# EAGLE schematic FPGA-Validation (EAGLE 9.4.2)

## Sheet 1 of 7
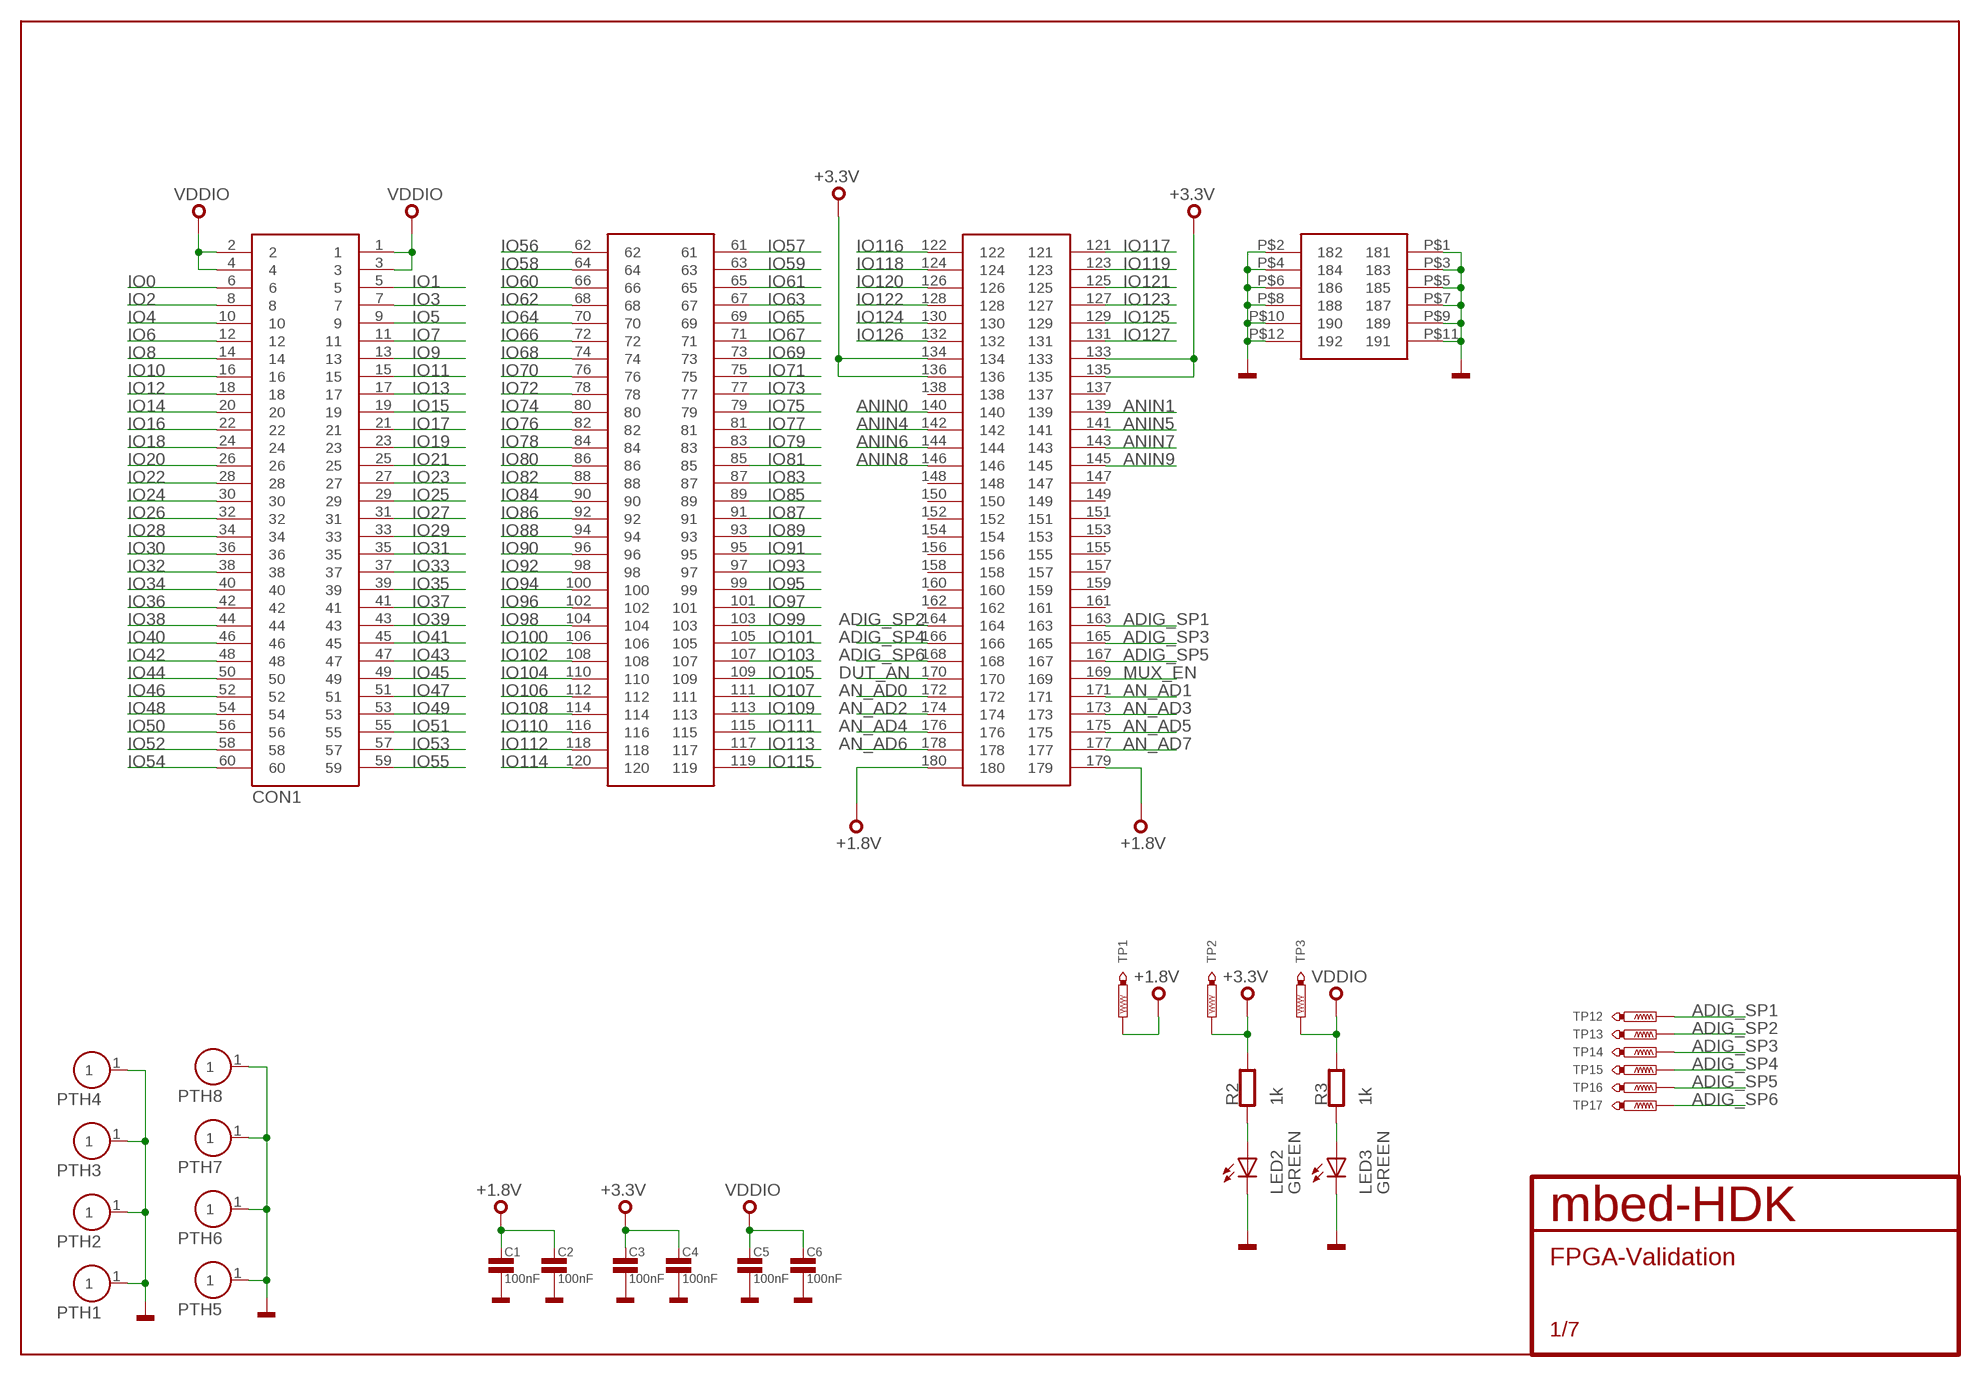
[diagram p0: schematic, sheet 1]

### Parts
C1  100nF  C0603  [0603]
C2  100nF  C0603  [0603]
C3  100nF  C0603  [0603]
C4  100nF  C0603  [0603]
C5  100nF  C0603  [0603]
C6  100nF  C0603  [0603]
CON1  QSH-090-01-L-D-A  [QSH-090-01-L-D-A]
LED2  GREEN  LED0603  [CHIPLED_0603]
LED3  GREEN  LED0603  [CHIPLED_0603]
PTH1  FIXINGHOLE  [PTH-140-300]
PTH2  FIXINGHOLE  [PTH-140-300]
PTH3  FIXINGHOLE  [PTH-140-300]
PTH4  FIXINGHOLE  [PTH-140-300]
PTH5  FIXINGHOLE  [PTH-140-300]
PTH6  FIXINGHOLE  [PTH-140-300]
PTH7  FIXINGHOLE  [PTH-140-300]
PTH8  FIXINGHOLE  [PTH-140-300]
R2  1k  R0603  [0603]
R3  1k  R0603  [0603]
TP1  TEST_POINT-50R-PTH  [TP50-PTH]
TP2  TEST_POINT-50R-PTH  [TP50-PTH]
TP3  TEST_POINT-50R-PTH  [TP50-PTH]
TP12  TEST_POINT-25R-SMD  [TP25-SMD]
TP13  TEST_POINT-25R-SMD  [TP25-SMD]
TP14  TEST_POINT-25R-SMD  [TP25-SMD]
TP15  TEST_POINT-25R-SMD  [TP25-SMD]
TP16  TEST_POINT-25R-SMD  [TP25-SMD]
TP17  TEST_POINT-25R-SMD  [TP25-SMD]

### Nets
+1.8V: C1.1 C2.1 CON1.179 CON1.180 TP1.TP ; also sheet 3,5
+3.3V: C3.1 C4.1 CON1.133 CON1.134 CON1.135 CON1.136 R2.2 TP2.TP ; also sheet 3,4,5
ADIG_SP1: CON1.163 TP12.TP
ADIG_SP2: CON1.164 TP13.TP
ADIG_SP3: CON1.165 TP14.TP
ADIG_SP4: CON1.166 TP15.TP
ADIG_SP5: CON1.167 TP16.TP
ADIG_SP6: CON1.168 TP17.TP
AN_AD0: CON1.172 ; also sheet 3,4,5
AN_AD1: CON1.171 ; also sheet 3,4,5
AN_AD2: CON1.174 ; also sheet 3,4,5
AN_AD3: CON1.173 ; also sheet 3,4,5
AN_AD4: CON1.176 ; also sheet 3,5
AN_AD5: CON1.175 ; also sheet 3,5
AN_AD6: CON1.178 ; also sheet 3,5
AN_AD7: CON1.177 ; also sheet 3,5
ANIN0: CON1.140 ; also sheet 3
ANIN1: CON1.139 ; also sheet 3
ANIN4: CON1.142 ; also sheet 3
ANIN5: CON1.141 ; also sheet 3
ANIN6: CON1.144 ; also sheet 3
ANIN7: CON1.143 ; also sheet 3
ANIN8: CON1.146 ; also sheet 3
ANIN9: CON1.145 ; also sheet 3
DUT_AN: CON1.170 ; also sheet 3,5
GND: C1.2 C2.2 C3.2 C4.2 C5.2 C6.2 CON1.P$1 CON1.P$2 CON1.P$3 CON1.P$4 CON1.P$5 CON1.P$6 CON1.P$7 CON1.P$8 CON1.P$9 CON1.P$10 CON1.P$11 CON1.P$12 LED2.C LED3.C PTH1.1 PTH2.1 PTH3.1 PTH4.1 PTH5.1 PTH6.1 PTH7.1 PTH8.1 ; also sheet 3,4,5,6,7
IO0: CON1.6 ; also sheet 2,4
IO1: CON1.5 ; also sheet 2,4
IO2: CON1.8 ; also sheet 2,4
IO3: CON1.7 ; also sheet 2,4
IO4: CON1.10 ; also sheet 2,4
IO5: CON1.9 ; also sheet 2,4
IO6: CON1.12 ; also sheet 2,4
IO7: CON1.11 ; also sheet 2,4
IO8: CON1.14 ; also sheet 2,4
IO9: CON1.13 ; also sheet 2,4
IO10: CON1.16 ; also sheet 2,4
IO11: CON1.15 ; also sheet 2,4
IO12: CON1.18 ; also sheet 2,4
IO13: CON1.17 ; also sheet 2,4
IO14: CON1.20 ; also sheet 2,4
IO15: CON1.19 ; also sheet 2,4
IO16: CON1.22 ; also sheet 2,4
IO17: CON1.21 ; also sheet 2,4
IO18: CON1.24 ; also sheet 2,4
IO19: CON1.23 ; also sheet 2,4
IO20: CON1.26 ; also sheet 2,4
IO21: CON1.25 ; also sheet 2,4
IO22: CON1.28 ; also sheet 2,4
IO23: CON1.27 ; also sheet 2,4
IO24: CON1.30 ; also sheet 2,4
IO25: CON1.29 ; also sheet 2,4
IO26: CON1.32 ; also sheet 2,4
IO27: CON1.31 ; also sheet 2,4
IO28: CON1.34 ; also sheet 2,4
IO29: CON1.33 ; also sheet 2,4
IO30: CON1.36 ; also sheet 2,4
IO31: CON1.35 ; also sheet 2,4
IO32: CON1.38 ; also sheet 2,4
IO33: CON1.37 ; also sheet 2,4
IO34: CON1.40 ; also sheet 2,4
IO35: CON1.39 ; also sheet 2,4
IO36: CON1.42 ; also sheet 2,4
IO37: CON1.41 ; also sheet 2,4
IO38: CON1.44 ; also sheet 2,4
IO39: CON1.43 ; also sheet 2,4
IO40: CON1.46 ; also sheet 2,4
IO41: CON1.45 ; also sheet 2,4
IO42: CON1.48 ; also sheet 2,4
IO43: CON1.47 ; also sheet 2,4
IO44: CON1.50 ; also sheet 2,4
IO45: CON1.49 ; also sheet 2,4
IO46: CON1.52 ; also sheet 2,4
IO47: CON1.51 ; also sheet 2,4
IO48: CON1.54 ; also sheet 2,4
IO49: CON1.53 ; also sheet 2,4
IO50: CON1.56 ; also sheet 2,4
IO51: CON1.55 ; also sheet 2,4
IO52: CON1.58 ; also sheet 2,4
IO53: CON1.57 ; also sheet 2,4
IO54: CON1.60 ; also sheet 2,4
IO55: CON1.59 ; also sheet 2,4
IO56: CON1.62 ; also sheet 2,4
IO57: CON1.61 ; also sheet 2,4
IO58: CON1.64 ; also sheet 2,4
IO59: CON1.63 ; also sheet 2,4
IO60: CON1.66 ; also sheet 2,4
IO61: CON1.65 ; also sheet 2,4
IO62: CON1.68 ; also sheet 2,4
IO63: CON1.67 ; also sheet 2,4
IO64: CON1.70 ; also sheet 2,5
IO65: CON1.69 ; also sheet 2,5
IO66: CON1.72 ; also sheet 2,5
IO67: CON1.71 ; also sheet 2,5
IO68: CON1.74 ; also sheet 2,5
IO69: CON1.73 ; also sheet 2,5
IO70: CON1.76 ; also sheet 2,5
IO71: CON1.75 ; also sheet 2,5
IO72: CON1.78 ; also sheet 2,5
IO73: CON1.77 ; also sheet 2,5
IO74: CON1.80 ; also sheet 2,5
IO75: CON1.79 ; also sheet 2,5
IO76: CON1.82 ; also sheet 2,5
IO77: CON1.81 ; also sheet 2,5
IO78: CON1.84 ; also sheet 2,5
IO79: CON1.83 ; also sheet 2,5
IO80: CON1.86 ; also sheet 2,5
IO81: CON1.85 ; also sheet 2,5
IO82: CON1.88 ; also sheet 2,5
IO83: CON1.87 ; also sheet 2,5
IO84: CON1.90 ; also sheet 2,5
IO85: CON1.89 ; also sheet 2,5
IO86: CON1.92 ; also sheet 2,5
IO87: CON1.91 ; also sheet 2,5
IO88: CON1.94 ; also sheet 2,5
IO89: CON1.93 ; also sheet 2,5
IO90: CON1.96 ; also sheet 2,5
IO91: CON1.95 ; also sheet 2,5
IO92: CON1.98 ; also sheet 2,5
IO93: CON1.97 ; also sheet 2,5
IO94: CON1.100 ; also sheet 2,5
IO95: CON1.99 ; also sheet 2,5
IO96: CON1.102 ; also sheet 2,5
IO97: CON1.101 ; also sheet 2,5
IO98: CON1.104 ; also sheet 2,5
IO99: CON1.103 ; also sheet 2,5
IO100: CON1.106 ; also sheet 2,5
IO101: CON1.105 ; also sheet 2,5
IO102: CON1.108 ; also sheet 2,5
IO103: CON1.107 ; also sheet 2,5
IO104: CON1.110 ; also sheet 2,5
IO105: CON1.109 ; also sheet 2,5
IO106: CON1.112 ; also sheet 2,5
IO107: CON1.111 ; also sheet 2,5
IO108: CON1.114 ; also sheet 2,5
IO109: CON1.113 ; also sheet 2,5
IO110: CON1.116 ; also sheet 2,5
IO111: CON1.115 ; also sheet 2,5
IO112: CON1.118 ; also sheet 2,5
IO113: CON1.117 ; also sheet 2,5
IO114: CON1.120 ; also sheet 2,5
IO115: CON1.119 ; also sheet 2,5
IO116: CON1.122 ; also sheet 2,5
IO117: CON1.121 ; also sheet 2,5
IO118: CON1.124 ; also sheet 2,5
IO119: CON1.123 ; also sheet 2,5
IO120: CON1.126 ; also sheet 2,5
IO121: CON1.125 ; also sheet 2,5
IO122: CON1.128 ; also sheet 2,5
IO123: CON1.127 ; also sheet 2,5
IO124: CON1.130 ; also sheet 2,5
IO125: CON1.129 ; also sheet 2,5
IO126: CON1.132 ; also sheet 2,5
IO127: CON1.131 ; also sheet 2,5
MUX_EN: CON1.169 ; also sheet 3,4,5
N$1: LED3.A R3.1
N$3: LED2.A R2.1
VDDIO: C5.1 C6.1 CON1.1 CON1.2 CON1.3 CON1.4 R3.2 TP3.TP ; also sheet 3,5
Unconnected: CON1.137 CON1.138 CON1.147 CON1.148 CON1.149 CON1.150 CON1.151 CON1.152 CON1.153 CON1.154 CON1.155 CON1.156 CON1.157 CON1.158 CON1.159 CON1.160 CON1.161 CON1.162

## Sheet 2 of 7
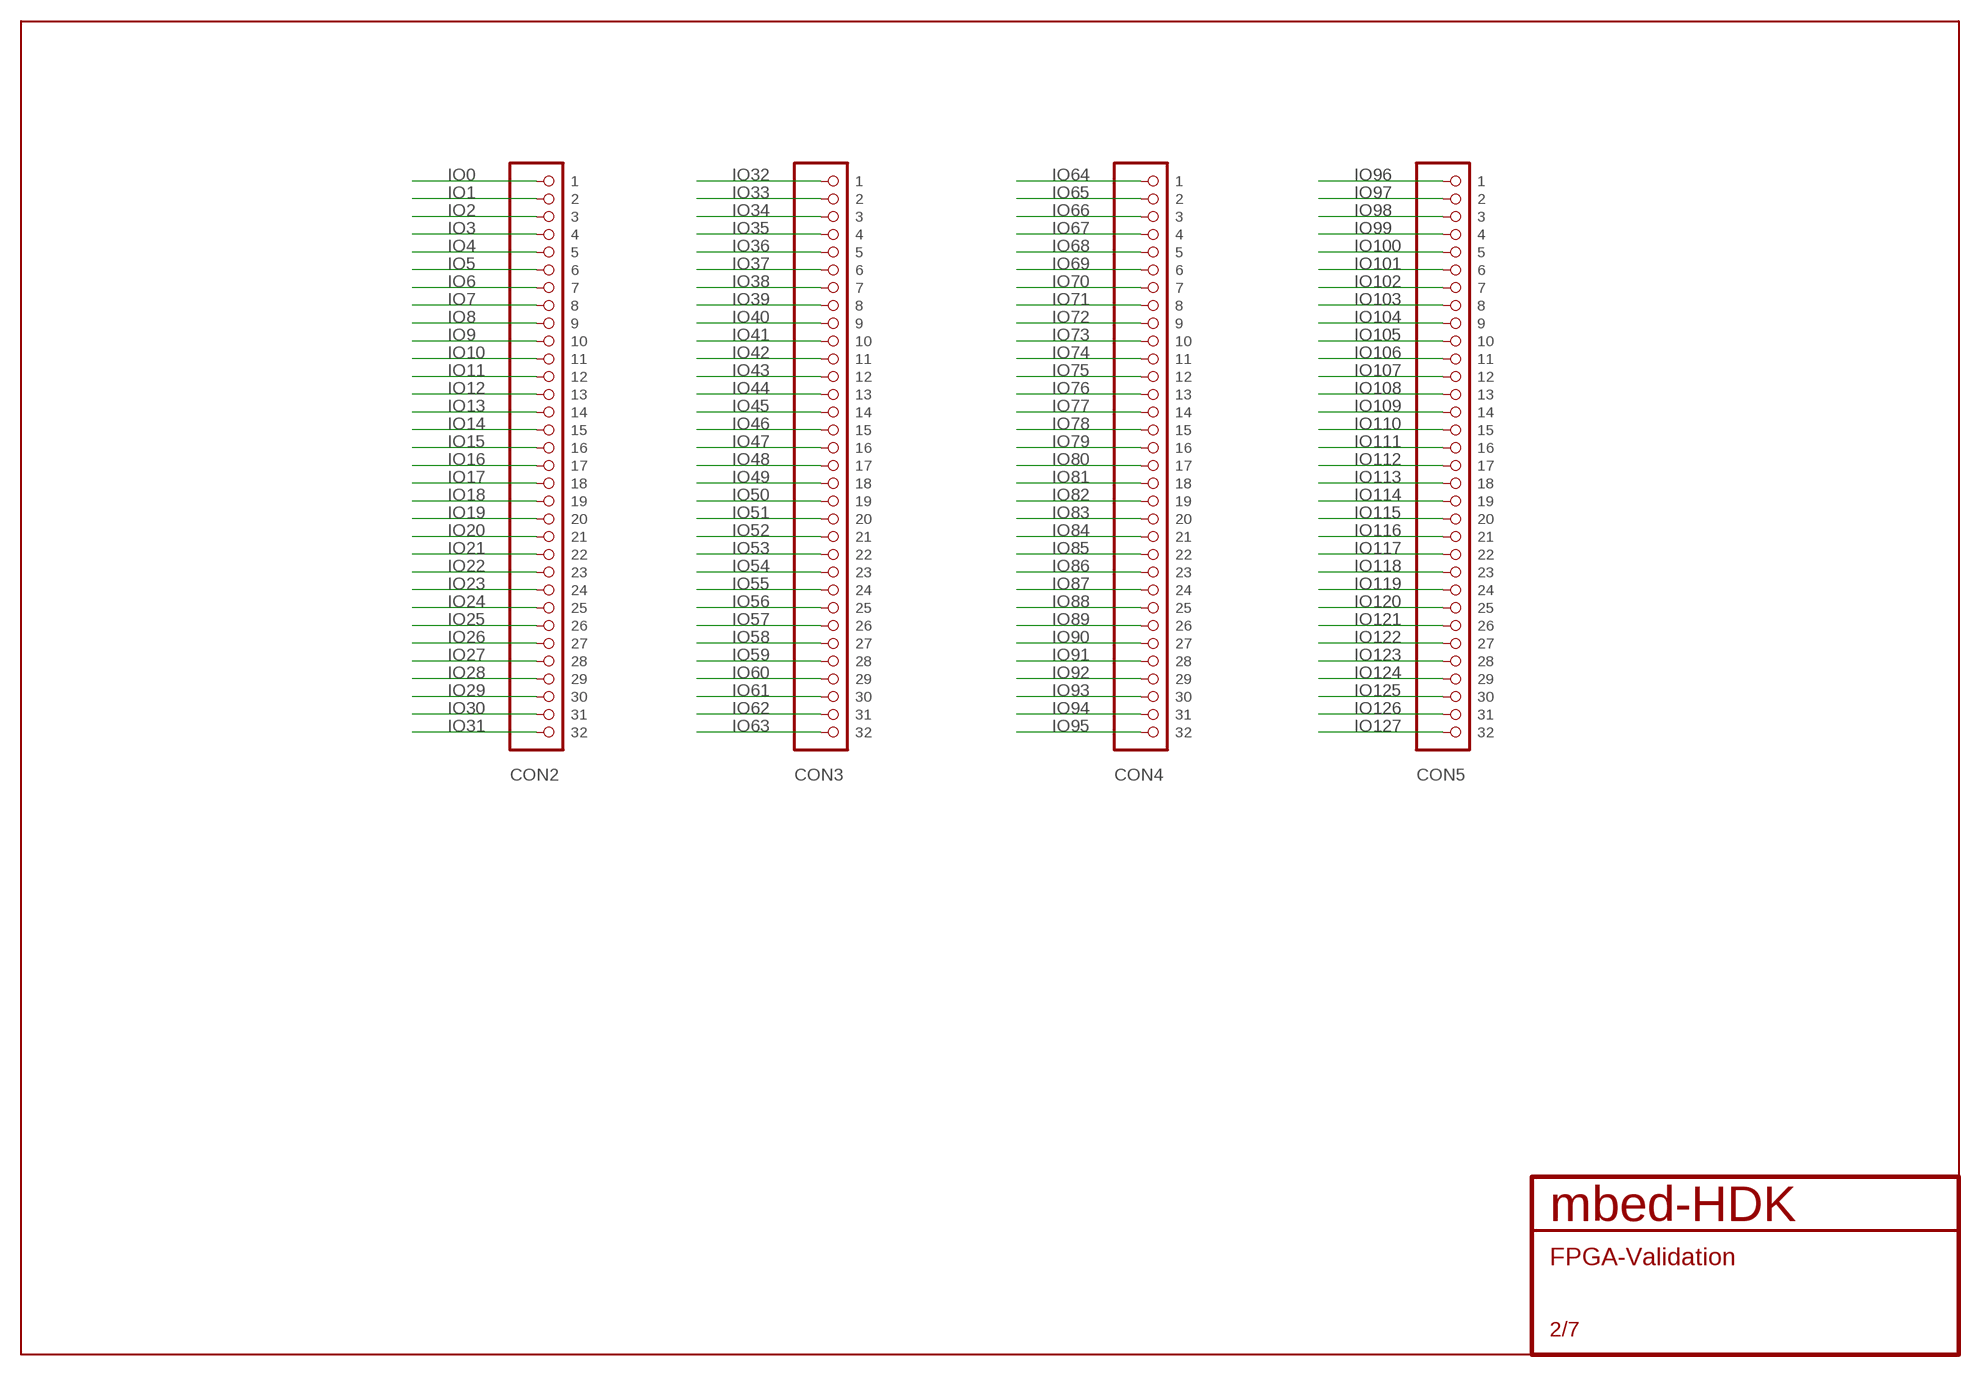
[diagram p1: schematic, sheet 2]

### Parts
CON2  PINHD-1X32  [1X32]
CON3  PINHD-1X32  [1X32]
CON4  PINHD-1X32  [1X32]
CON5  PINHD-1X32  [1X32]

### Nets
IO0: CON2.1 ; also sheet 1,4
IO1: CON2.2 ; also sheet 1,4
IO2: CON2.3 ; also sheet 1,4
IO3: CON2.4 ; also sheet 1,4
IO4: CON2.5 ; also sheet 1,4
IO5: CON2.6 ; also sheet 1,4
IO6: CON2.7 ; also sheet 1,4
IO7: CON2.8 ; also sheet 1,4
IO8: CON2.9 ; also sheet 1,4
IO9: CON2.10 ; also sheet 1,4
IO10: CON2.11 ; also sheet 1,4
IO11: CON2.12 ; also sheet 1,4
IO12: CON2.13 ; also sheet 1,4
IO13: CON2.14 ; also sheet 1,4
IO14: CON2.15 ; also sheet 1,4
IO15: CON2.16 ; also sheet 1,4
IO16: CON2.17 ; also sheet 1,4
IO17: CON2.18 ; also sheet 1,4
IO18: CON2.19 ; also sheet 1,4
IO19: CON2.20 ; also sheet 1,4
IO20: CON2.21 ; also sheet 1,4
IO21: CON2.22 ; also sheet 1,4
IO22: CON2.23 ; also sheet 1,4
IO23: CON2.24 ; also sheet 1,4
IO24: CON2.25 ; also sheet 1,4
IO25: CON2.26 ; also sheet 1,4
IO26: CON2.27 ; also sheet 1,4
IO27: CON2.28 ; also sheet 1,4
IO28: CON2.29 ; also sheet 1,4
IO29: CON2.30 ; also sheet 1,4
IO30: CON2.31 ; also sheet 1,4
IO31: CON2.32 ; also sheet 1,4
IO32: CON3.1 ; also sheet 1,4
IO33: CON3.2 ; also sheet 1,4
IO34: CON3.3 ; also sheet 1,4
IO35: CON3.4 ; also sheet 1,4
IO36: CON3.5 ; also sheet 1,4
IO37: CON3.6 ; also sheet 1,4
IO38: CON3.7 ; also sheet 1,4
IO39: CON3.8 ; also sheet 1,4
IO40: CON3.9 ; also sheet 1,4
IO41: CON3.10 ; also sheet 1,4
IO42: CON3.11 ; also sheet 1,4
IO43: CON3.12 ; also sheet 1,4
IO44: CON3.13 ; also sheet 1,4
IO45: CON3.14 ; also sheet 1,4
IO46: CON3.15 ; also sheet 1,4
IO47: CON3.16 ; also sheet 1,4
IO48: CON3.17 ; also sheet 1,4
IO49: CON3.18 ; also sheet 1,4
IO50: CON3.19 ; also sheet 1,4
IO51: CON3.20 ; also sheet 1,4
IO52: CON3.21 ; also sheet 1,4
IO53: CON3.22 ; also sheet 1,4
IO54: CON3.23 ; also sheet 1,4
IO55: CON3.24 ; also sheet 1,4
IO56: CON3.25 ; also sheet 1,4
IO57: CON3.26 ; also sheet 1,4
IO58: CON3.27 ; also sheet 1,4
IO59: CON3.28 ; also sheet 1,4
IO60: CON3.29 ; also sheet 1,4
IO61: CON3.30 ; also sheet 1,4
IO62: CON3.31 ; also sheet 1,4
IO63: CON3.32 ; also sheet 1,4
IO64: CON4.1 ; also sheet 1,5
IO65: CON4.2 ; also sheet 1,5
IO66: CON4.3 ; also sheet 1,5
IO67: CON4.4 ; also sheet 1,5
IO68: CON4.5 ; also sheet 1,5
IO69: CON4.6 ; also sheet 1,5
IO70: CON4.7 ; also sheet 1,5
IO71: CON4.8 ; also sheet 1,5
IO72: CON4.9 ; also sheet 1,5
IO73: CON4.10 ; also sheet 1,5
IO74: CON4.11 ; also sheet 1,5
IO75: CON4.12 ; also sheet 1,5
IO76: CON4.13 ; also sheet 1,5
IO77: CON4.14 ; also sheet 1,5
IO78: CON4.15 ; also sheet 1,5
IO79: CON4.16 ; also sheet 1,5
IO80: CON4.17 ; also sheet 1,5
IO81: CON4.18 ; also sheet 1,5
IO82: CON4.19 ; also sheet 1,5
IO83: CON4.20 ; also sheet 1,5
IO84: CON4.21 ; also sheet 1,5
IO85: CON4.22 ; also sheet 1,5
IO86: CON4.23 ; also sheet 1,5
IO87: CON4.24 ; also sheet 1,5
IO88: CON4.25 ; also sheet 1,5
IO89: CON4.26 ; also sheet 1,5
IO90: CON4.27 ; also sheet 1,5
IO91: CON4.28 ; also sheet 1,5
IO92: CON4.29 ; also sheet 1,5
IO93: CON4.30 ; also sheet 1,5
IO94: CON4.31 ; also sheet 1,5
IO95: CON4.32 ; also sheet 1,5
IO96: CON5.1 ; also sheet 1,5
IO97: CON5.2 ; also sheet 1,5
IO98: CON5.3 ; also sheet 1,5
IO99: CON5.4 ; also sheet 1,5
IO100: CON5.5 ; also sheet 1,5
IO101: CON5.6 ; also sheet 1,5
IO102: CON5.7 ; also sheet 1,5
IO103: CON5.8 ; also sheet 1,5
IO104: CON5.9 ; also sheet 1,5
IO105: CON5.10 ; also sheet 1,5
IO106: CON5.11 ; also sheet 1,5
IO107: CON5.12 ; also sheet 1,5
IO108: CON5.13 ; also sheet 1,5
IO109: CON5.14 ; also sheet 1,5
IO110: CON5.15 ; also sheet 1,5
IO111: CON5.16 ; also sheet 1,5
IO112: CON5.17 ; also sheet 1,5
IO113: CON5.18 ; also sheet 1,5
IO114: CON5.19 ; also sheet 1,5
IO115: CON5.20 ; also sheet 1,5
IO116: CON5.21 ; also sheet 1,5
IO117: CON5.22 ; also sheet 1,5
IO118: CON5.23 ; also sheet 1,5
IO119: CON5.24 ; also sheet 1,5
IO120: CON5.25 ; also sheet 1,5
IO121: CON5.26 ; also sheet 1,5
IO122: CON5.27 ; also sheet 1,5
IO123: CON5.28 ; also sheet 1,5
IO124: CON5.29 ; also sheet 1,5
IO125: CON5.30 ; also sheet 1,5
IO126: CON5.31 ; also sheet 1,5
IO127: CON5.32 ; also sheet 1,5

## Sheet 3 of 7
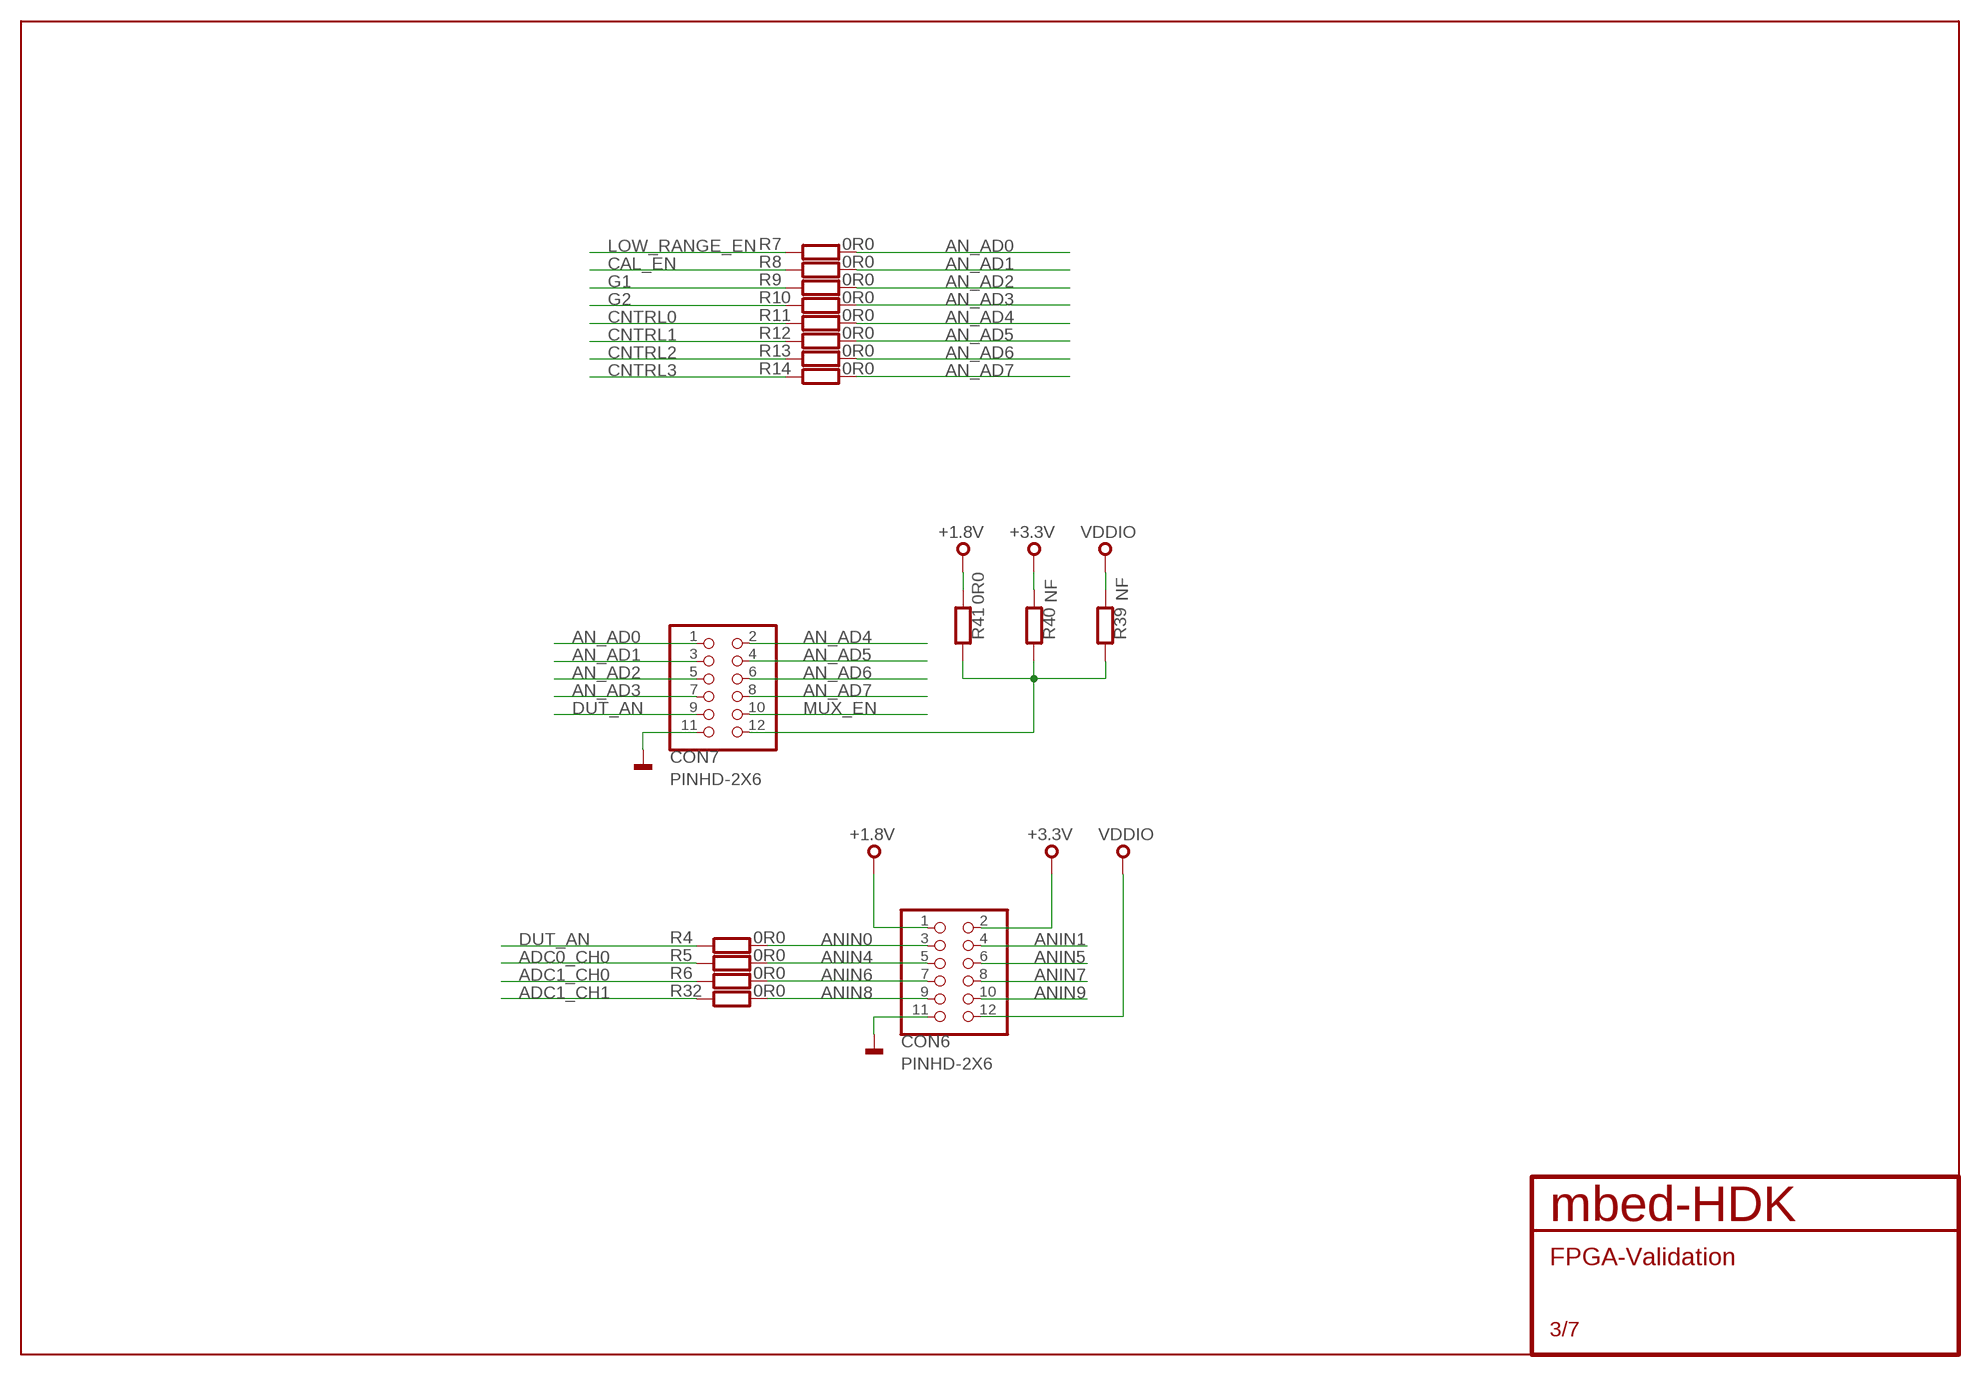
[diagram p2: schematic, sheet 3]

### Parts
CON6  PINHD-2X6  [2X06]
CON7  PINHD-2X6  [2X06]
R4  0R0  R0603  [0603]
R5  0R0  R0603  [0603]
R6  0R0  R0603  [0603]
R7  0R0  R0603  [0603]
R8  0R0  R0603  [0603]
R9  0R0  R0603  [0603]
R10  0R0  R0603  [0603]
R11  0R0  R0603  [0603]
R12  0R0  R0603  [0603]
R13  0R0  R0603  [0603]
R14  0R0  R0603  [0603]
R32  0R0  R0603  [0603]
R39  NF  R0603  [0603]
R40  NF  R0603  [0603]
R41  0R0  R0603  [0603]

### Nets
+1.8V: CON6.1 R41.1 ; also sheet 1,5
+3.3V: CON6.2 R40.1 ; also sheet 1,4,5
ADC0_CH0: R5.1 ; also sheet 6
ADC1_CH0: R6.1 ; also sheet 6
ADC1_CH1: R32.1 ; also sheet 6
AN_AD0: CON7.1 R7.2 ; also sheet 1,4,5
AN_AD1: CON7.3 R8.2 ; also sheet 1,4,5
AN_AD2: CON7.5 R9.2 ; also sheet 1,4,5
AN_AD3: CON7.7 R10.2 ; also sheet 1,4,5
AN_AD4: CON7.2 R11.2 ; also sheet 1,5
AN_AD5: CON7.4 R12.2 ; also sheet 1,5
AN_AD6: CON7.6 R13.2 ; also sheet 1,5
AN_AD7: CON7.8 R14.2 ; also sheet 1,5
ANIN0: CON6.3 R4.2 ; also sheet 1
ANIN1: CON6.4 ; also sheet 1
ANIN4: CON6.5 R5.2 ; also sheet 1
ANIN5: CON6.6 ; also sheet 1
ANIN6: CON6.7 R6.2 ; also sheet 1
ANIN7: CON6.8 ; also sheet 1
ANIN8: CON6.9 R32.2 ; also sheet 1
ANIN9: CON6.10 ; also sheet 1
CAL_EN: R8.1 ; also sheet 7
CNTRL0: R11.1 ; also sheet 7
CNTRL1: R12.1 ; also sheet 7
CNTRL2: R13.1 ; also sheet 7
CNTRL3: R14.1 ; also sheet 7
DUT_AN: CON7.9 R4.1 ; also sheet 1,5
G1: R9.1 ; also sheet 6
G2: R10.1 ; also sheet 6
GND: CON6.11 CON7.11 ; also sheet 1,4,5,6,7
LOW_RANGE_EN: R7.1 ; also sheet 7
MUX_EN: CON7.10 ; also sheet 1,4,5
N$8: CON7.12 R39.2 R40.2 R41.2
VDDIO: CON6.12 R39.1 ; also sheet 1,5

## Sheet 4 of 7
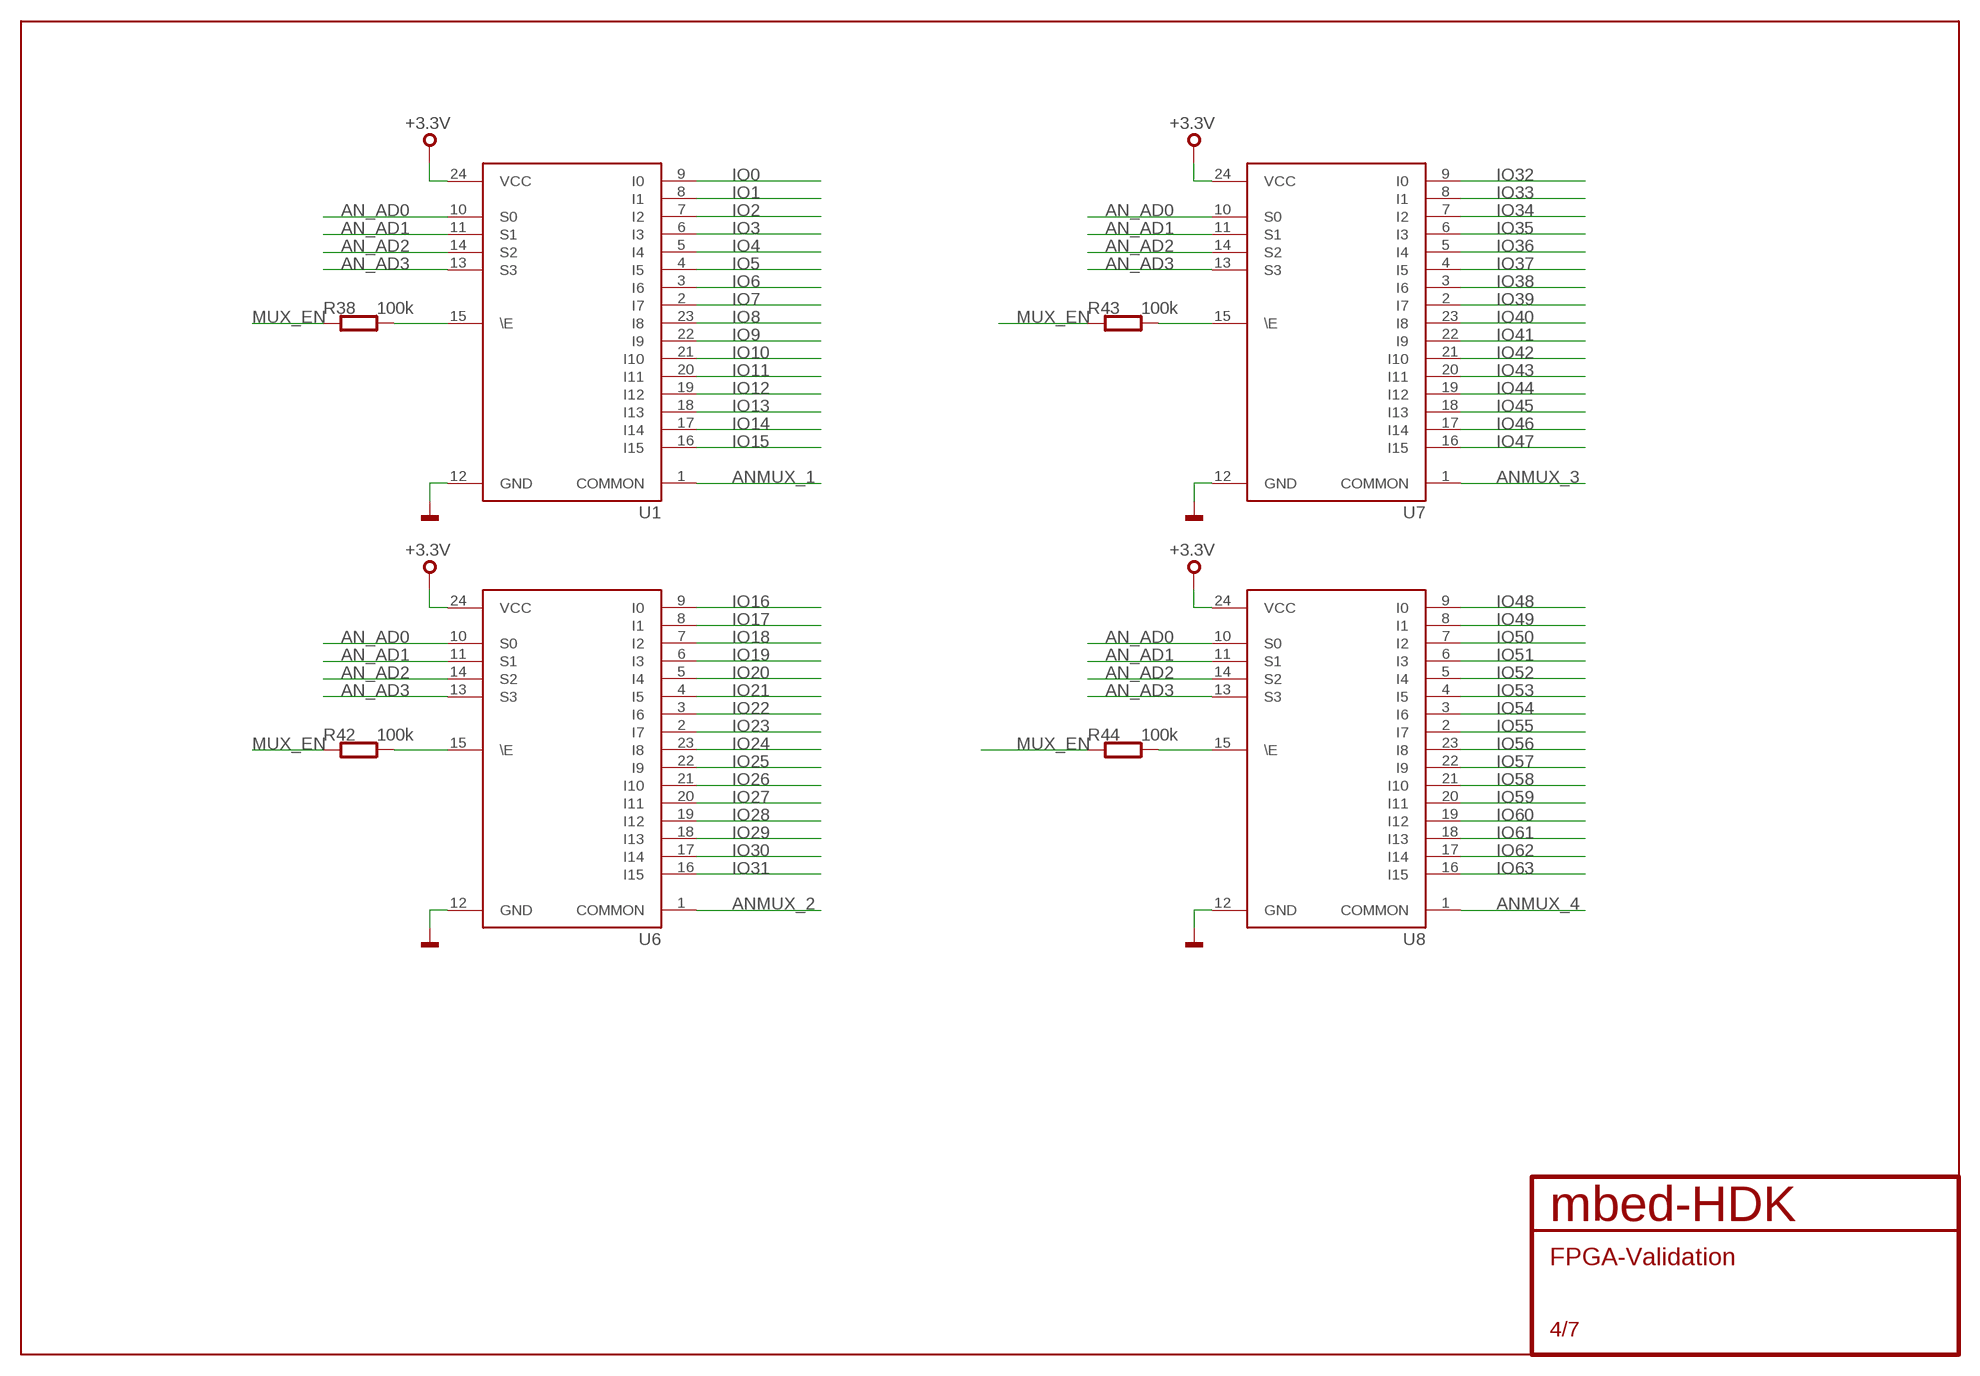
[diagram p3: schematic, sheet 4]

### Parts
R38  100k  R0603  [0603]
R42  100k  R0603  [0603]
R43  100k  R0603  [0603]
R44  100k  R0603  [0603]
U1  CD74HCT4067  [SO24]
U6  CD74HCT4067  [SO24]
U7  CD74HCT4067  [SO24]
U8  CD74HCT4067  [SO24]

### Nets
+3.3V: U1.24(VCC) U6.24(VCC) U7.24(VCC) U8.24(VCC) ; also sheet 1,3,5
AN_AD0: U1.10(S0) U6.10(S0) U7.10(S0) U8.10(S0) ; also sheet 1,3,5
AN_AD1: U1.11(S1) U6.11(S1) U7.11(S1) U8.11(S1) ; also sheet 1,3,5
AN_AD2: U1.14(S2) U6.14(S2) U7.14(S2) U8.14(S2) ; also sheet 1,3,5
AN_AD3: U1.13(S3) U6.13(S3) U7.13(S3) U8.13(S3) ; also sheet 1,3,5
ANMUX_1: U1.1(COMMON) ; also sheet 5
ANMUX_2: U6.1(COMMON) ; also sheet 5
ANMUX_3: U7.1(COMMON) ; also sheet 5
ANMUX_4: U8.1(COMMON) ; also sheet 5
GND: U1.12(GND) U6.12(GND) U7.12(GND) U8.12(GND) ; also sheet 1,3,5,6,7
IO0: U1.9(I0) ; also sheet 1,2
IO1: U1.8(I1) ; also sheet 1,2
IO2: U1.7(I2) ; also sheet 1,2
IO3: U1.6(I3) ; also sheet 1,2
IO4: U1.5(I4) ; also sheet 1,2
IO5: U1.4(I5) ; also sheet 1,2
IO6: U1.3(I6) ; also sheet 1,2
IO7: U1.2(I7) ; also sheet 1,2
IO8: U1.23(I8) ; also sheet 1,2
IO9: U1.22(I9) ; also sheet 1,2
IO10: U1.21(I10) ; also sheet 1,2
IO11: U1.20(I11) ; also sheet 1,2
IO12: U1.19(I12) ; also sheet 1,2
IO13: U1.18(I13) ; also sheet 1,2
IO14: U1.17(I14) ; also sheet 1,2
IO15: U1.16(I15) ; also sheet 1,2
IO16: U6.9(I0) ; also sheet 1,2
IO17: U6.8(I1) ; also sheet 1,2
IO18: U6.7(I2) ; also sheet 1,2
IO19: U6.6(I3) ; also sheet 1,2
IO20: U6.5(I4) ; also sheet 1,2
IO21: U6.4(I5) ; also sheet 1,2
IO22: U6.3(I6) ; also sheet 1,2
IO23: U6.2(I7) ; also sheet 1,2
IO24: U6.23(I8) ; also sheet 1,2
IO25: U6.22(I9) ; also sheet 1,2
IO26: U6.21(I10) ; also sheet 1,2
IO27: U6.20(I11) ; also sheet 1,2
IO28: U6.19(I12) ; also sheet 1,2
IO29: U6.18(I13) ; also sheet 1,2
IO30: U6.17(I14) ; also sheet 1,2
IO31: U6.16(I15) ; also sheet 1,2
IO32: U7.9(I0) ; also sheet 1,2
IO33: U7.8(I1) ; also sheet 1,2
IO34: U7.7(I2) ; also sheet 1,2
IO35: U7.6(I3) ; also sheet 1,2
IO36: U7.5(I4) ; also sheet 1,2
IO37: U7.4(I5) ; also sheet 1,2
IO38: U7.3(I6) ; also sheet 1,2
IO39: U7.2(I7) ; also sheet 1,2
IO40: U7.23(I8) ; also sheet 1,2
IO41: U7.22(I9) ; also sheet 1,2
IO42: U7.21(I10) ; also sheet 1,2
IO43: U7.20(I11) ; also sheet 1,2
IO44: U7.19(I12) ; also sheet 1,2
IO45: U7.18(I13) ; also sheet 1,2
IO46: U7.17(I14) ; also sheet 1,2
IO47: U7.16(I15) ; also sheet 1,2
IO48: U8.9(I0) ; also sheet 1,2
IO49: U8.8(I1) ; also sheet 1,2
IO50: U8.7(I2) ; also sheet 1,2
IO51: U8.6(I3) ; also sheet 1,2
IO52: U8.5(I4) ; also sheet 1,2
IO53: U8.4(I5) ; also sheet 1,2
IO54: U8.3(I6) ; also sheet 1,2
IO55: U8.2(I7) ; also sheet 1,2
IO56: U8.23(I8) ; also sheet 1,2
IO57: U8.22(I9) ; also sheet 1,2
IO58: U8.21(I10) ; also sheet 1,2
IO59: U8.20(I11) ; also sheet 1,2
IO60: U8.19(I12) ; also sheet 1,2
IO61: U8.18(I13) ; also sheet 1,2
IO62: U8.17(I14) ; also sheet 1,2
IO63: U8.16(I15) ; also sheet 1,2
MUX_EN: R38.1 R42.1 R43.1 R44.1 ; also sheet 1,3,5
N$4: R42.2 U6.15(\E)
N$9: R43.2 U7.15(\E)
N$10: R38.2 U1.15(\E)
N$11: R44.2 U8.15(\E)

## Sheet 5 of 7
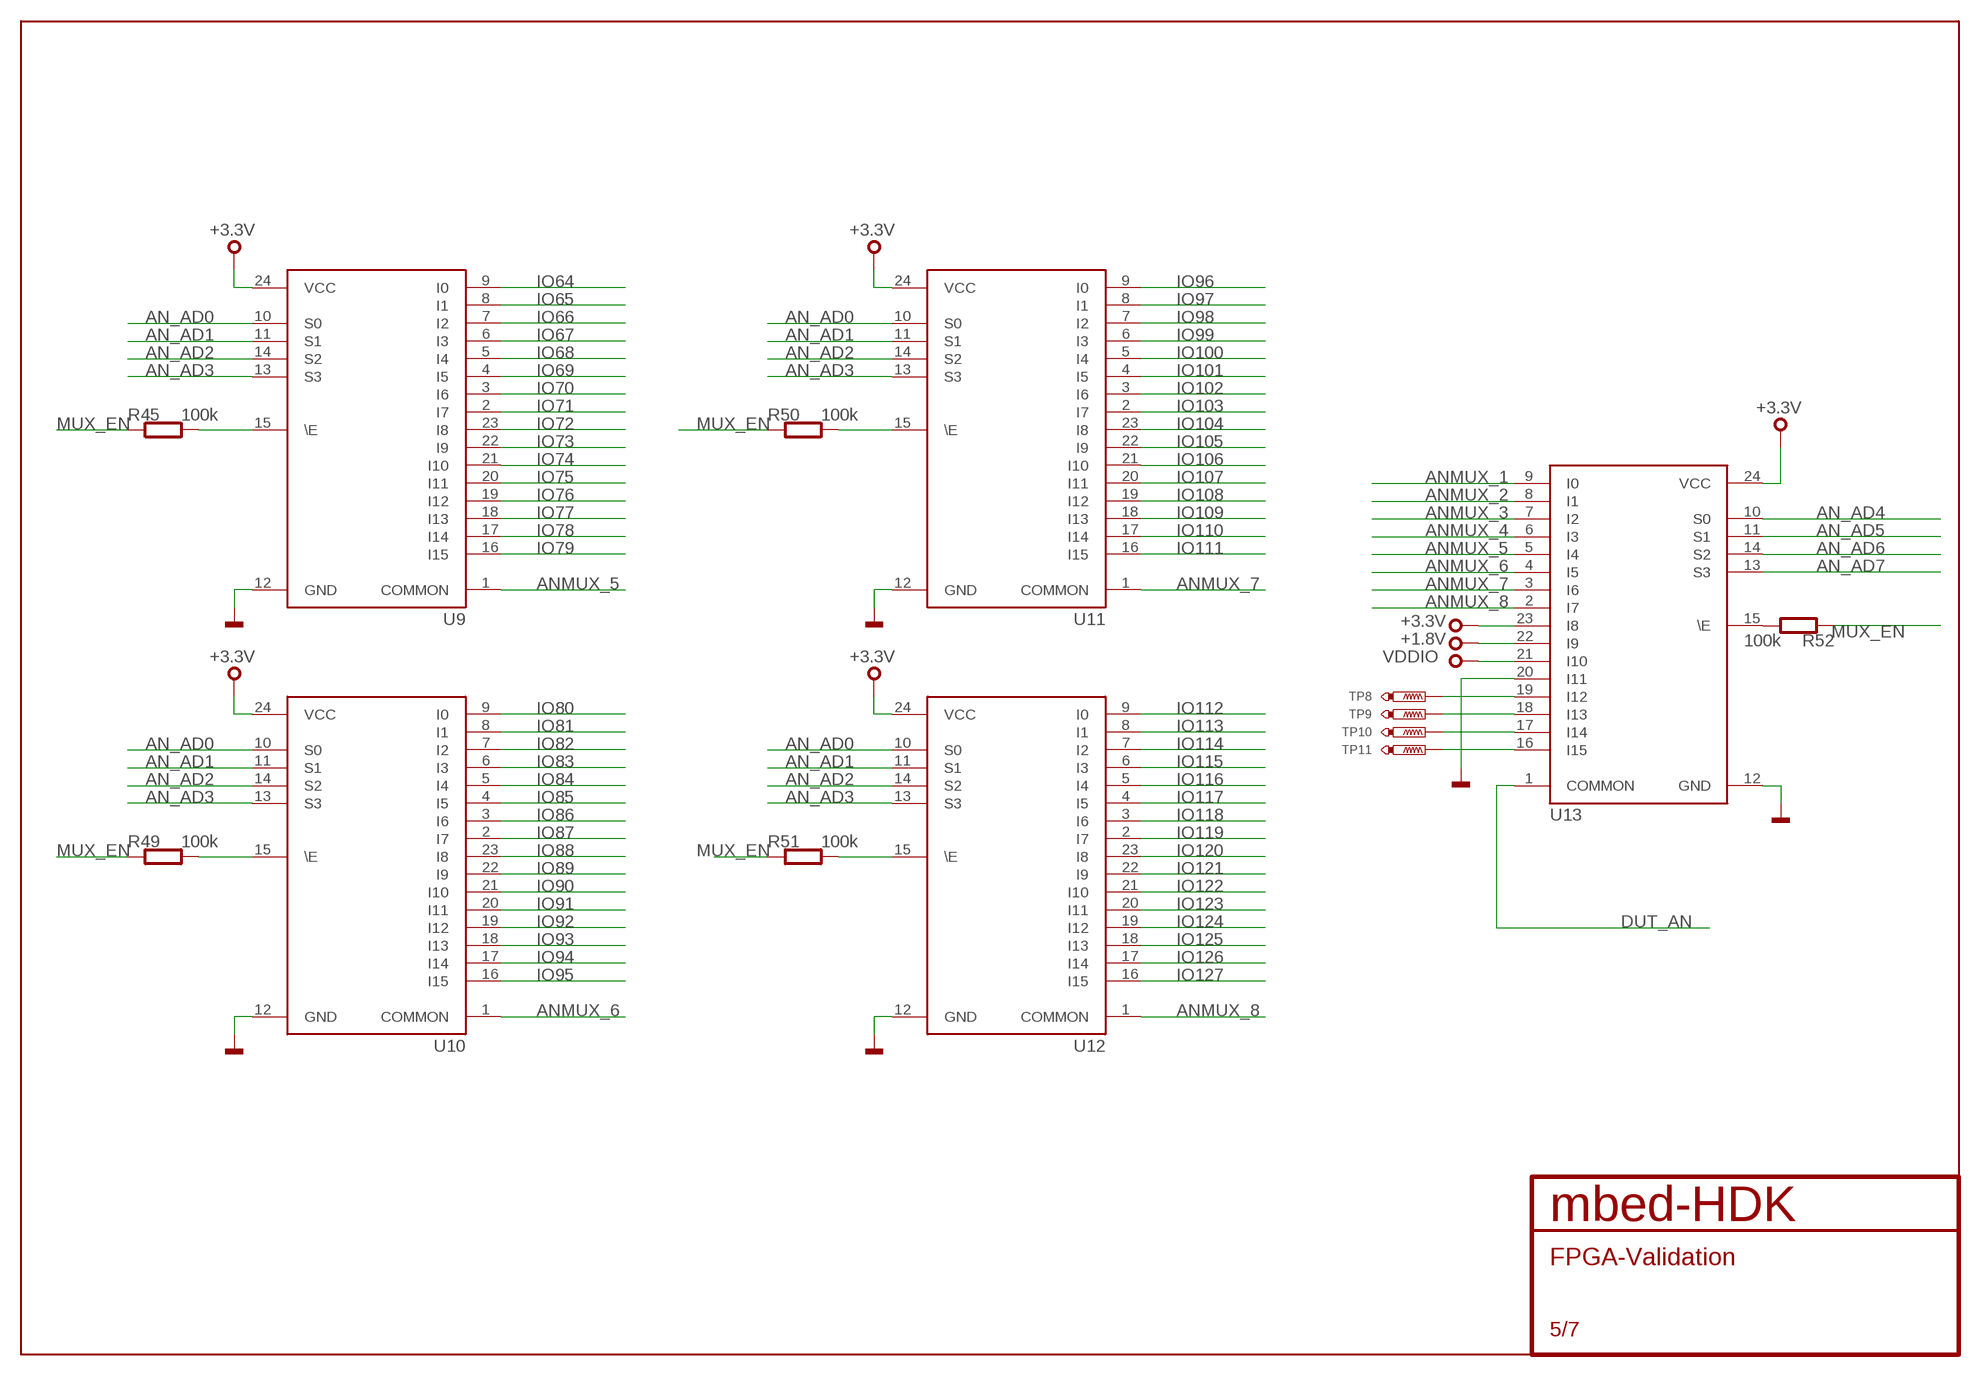
[diagram p4: schematic, sheet 5]

### Parts
R45  100k  R0603  [0603]
R49  100k  R0603  [0603]
R50  100k  R0603  [0603]
R51  100k  R0603  [0603]
R52  100k  R0603  [0603]
TP8  TEST_POINT-50R-PTH  [TP50-PTH]
TP9  TEST_POINT-50R-PTH  [TP50-PTH]
TP10  TEST_POINT-50R-PTH  [TP50-PTH]
TP11  TEST_POINT-50R-PTH  [TP50-PTH]
U9  CD74HCT4067  [SO24]
U10  CD74HCT4067  [SO24]
U11  CD74HCT4067  [SO24]
U12  CD74HCT4067  [SO24]
U13  CD74HCT4067  [SO24]

### Nets
+1.8V: U13.22(I9) ; also sheet 1,3
+3.3V: U9.24(VCC) U10.24(VCC) U11.24(VCC) U12.24(VCC) U13.23(I8) U13.24(VCC) ; also sheet 1,3,4
AN_AD0: U9.10(S0) U10.10(S0) U11.10(S0) U12.10(S0) ; also sheet 1,3,4
AN_AD1: U9.11(S1) U10.11(S1) U11.11(S1) U12.11(S1) ; also sheet 1,3,4
AN_AD2: U9.14(S2) U10.14(S2) U11.14(S2) U12.14(S2) ; also sheet 1,3,4
AN_AD3: U9.13(S3) U10.13(S3) U11.13(S3) U12.13(S3) ; also sheet 1,3,4
AN_AD4: U13.10(S0) ; also sheet 1,3
AN_AD5: U13.11(S1) ; also sheet 1,3
AN_AD6: U13.14(S2) ; also sheet 1,3
AN_AD7: U13.13(S3) ; also sheet 1,3
ANMUX_1: U13.9(I0) ; also sheet 4
ANMUX_2: U13.8(I1) ; also sheet 4
ANMUX_3: U13.7(I2) ; also sheet 4
ANMUX_4: U13.6(I3) ; also sheet 4
ANMUX_5: U9.1(COMMON) U13.5(I4)
ANMUX_6: U10.1(COMMON) U13.4(I5)
ANMUX_7: U11.1(COMMON) U13.3(I6)
ANMUX_8: U12.1(COMMON) U13.2(I7)
DUT_AN: U13.1(COMMON) ; also sheet 1,3
GND: U9.12(GND) U10.12(GND) U11.12(GND) U12.12(GND) U13.12(GND) U13.20(I11) ; also sheet 1,3,4,6,7
IO64: U9.9(I0) ; also sheet 1,2
IO65: U9.8(I1) ; also sheet 1,2
IO66: U9.7(I2) ; also sheet 1,2
IO67: U9.6(I3) ; also sheet 1,2
IO68: U9.5(I4) ; also sheet 1,2
IO69: U9.4(I5) ; also sheet 1,2
IO70: U9.3(I6) ; also sheet 1,2
IO71: U9.2(I7) ; also sheet 1,2
IO72: U9.23(I8) ; also sheet 1,2
IO73: U9.22(I9) ; also sheet 1,2
IO74: U9.21(I10) ; also sheet 1,2
IO75: U9.20(I11) ; also sheet 1,2
IO76: U9.19(I12) ; also sheet 1,2
IO77: U9.18(I13) ; also sheet 1,2
IO78: U9.17(I14) ; also sheet 1,2
IO79: U9.16(I15) ; also sheet 1,2
IO80: U10.9(I0) ; also sheet 1,2
IO81: U10.8(I1) ; also sheet 1,2
IO82: U10.7(I2) ; also sheet 1,2
IO83: U10.6(I3) ; also sheet 1,2
IO84: U10.5(I4) ; also sheet 1,2
IO85: U10.4(I5) ; also sheet 1,2
IO86: U10.3(I6) ; also sheet 1,2
IO87: U10.2(I7) ; also sheet 1,2
IO88: U10.23(I8) ; also sheet 1,2
IO89: U10.22(I9) ; also sheet 1,2
IO90: U10.21(I10) ; also sheet 1,2
IO91: U10.20(I11) ; also sheet 1,2
IO92: U10.19(I12) ; also sheet 1,2
IO93: U10.18(I13) ; also sheet 1,2
IO94: U10.17(I14) ; also sheet 1,2
IO95: U10.16(I15) ; also sheet 1,2
IO96: U11.9(I0) ; also sheet 1,2
IO97: U11.8(I1) ; also sheet 1,2
IO98: U11.7(I2) ; also sheet 1,2
IO99: U11.6(I3) ; also sheet 1,2
IO100: U11.5(I4) ; also sheet 1,2
IO101: U11.4(I5) ; also sheet 1,2
IO102: U11.3(I6) ; also sheet 1,2
IO103: U11.2(I7) ; also sheet 1,2
IO104: U11.23(I8) ; also sheet 1,2
IO105: U11.22(I9) ; also sheet 1,2
IO106: U11.21(I10) ; also sheet 1,2
IO107: U11.20(I11) ; also sheet 1,2
IO108: U11.19(I12) ; also sheet 1,2
IO109: U11.18(I13) ; also sheet 1,2
IO110: U11.17(I14) ; also sheet 1,2
IO111: U11.16(I15) ; also sheet 1,2
IO112: U12.9(I0) ; also sheet 1,2
IO113: U12.8(I1) ; also sheet 1,2
IO114: U12.7(I2) ; also sheet 1,2
IO115: U12.6(I3) ; also sheet 1,2
IO116: U12.5(I4) ; also sheet 1,2
IO117: U12.4(I5) ; also sheet 1,2
IO118: U12.3(I6) ; also sheet 1,2
IO119: U12.2(I7) ; also sheet 1,2
IO120: U12.23(I8) ; also sheet 1,2
IO121: U12.22(I9) ; also sheet 1,2
IO122: U12.21(I10) ; also sheet 1,2
IO123: U12.20(I11) ; also sheet 1,2
IO124: U12.19(I12) ; also sheet 1,2
IO125: U12.18(I13) ; also sheet 1,2
IO126: U12.17(I14) ; also sheet 1,2
IO127: U12.16(I15) ; also sheet 1,2
MUX_EN: R45.1 R49.1 R50.1 R51.1 R52.1 ; also sheet 1,3,4
N$12: R45.2 U9.15(\E)
N$13: R49.2 U10.15(\E)
N$15: R50.2 U11.15(\E)
N$16: R51.2 U12.15(\E)
N$18: R52.2 U13.15(\E)
N$19: TP8.TP U13.19(I12)
N$20: TP9.TP U13.18(I13)
N$21: TP10.TP U13.17(I14)
N$23: TP11.TP U13.16(I15)
VDDIO: U13.21(I10) ; also sheet 1,3

## Sheet 6 of 7
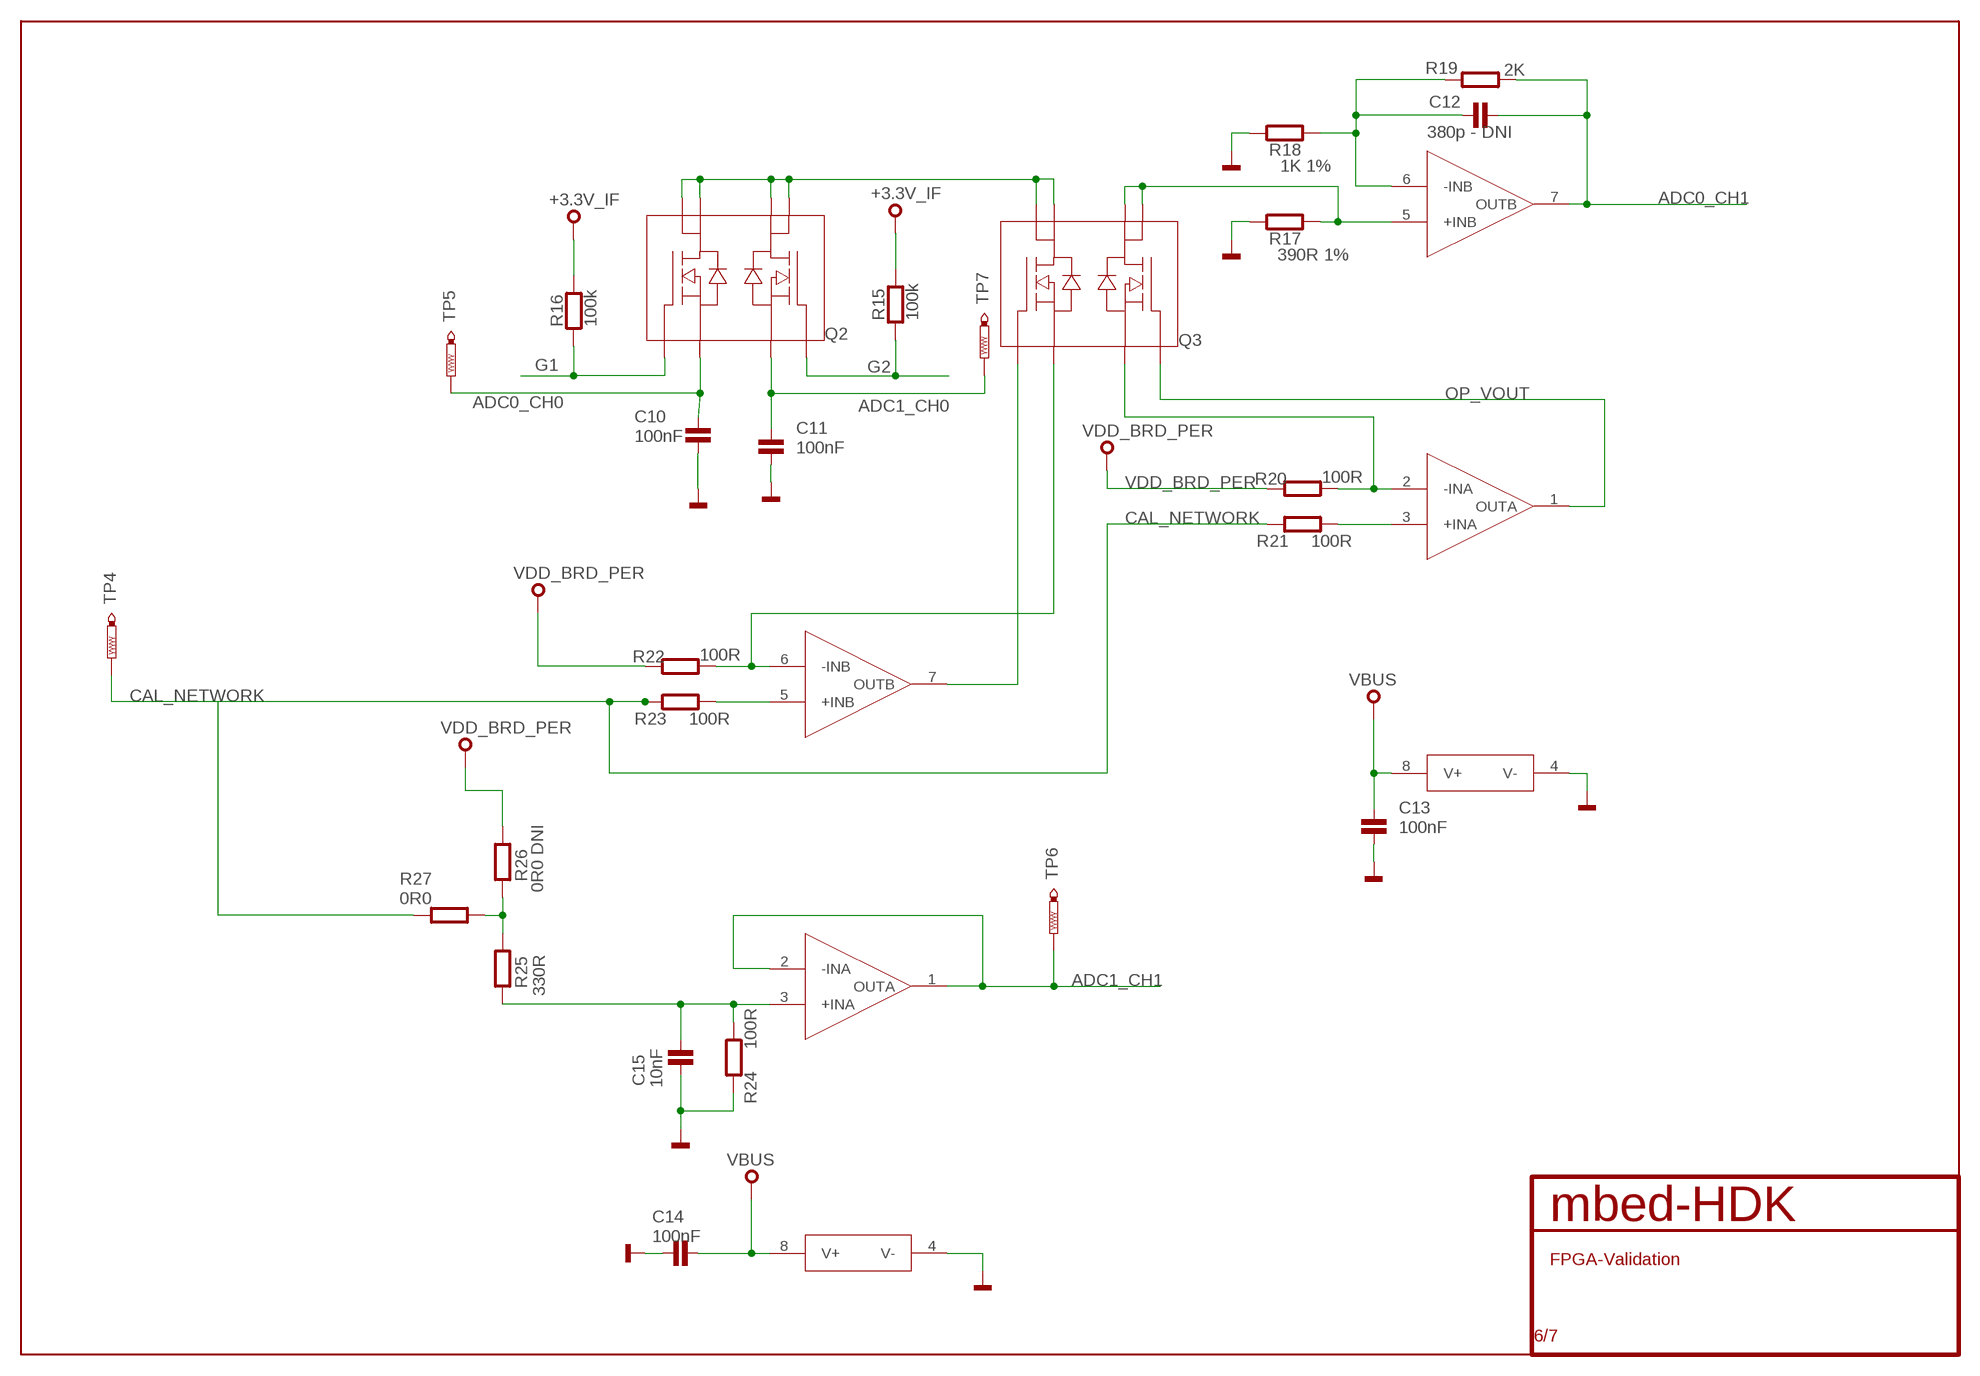
[diagram p5: schematic, sheet 6]

### Parts
C10  100nF  C0603  [0603]
C11  100nF  C0603  [0603]
C12  380p - DNI  C0603  [0603]
C13  100nF  C0603  [0603]
C14  100nF  C0603  [0603]
C15  10nF  C0603  [0603]
Q2  PMDPB55XP  [SOT1118]
Q3  PMDPB55XP  [SOT1118]
R15  100k  R0603  [0603@1]
R16  100k  R0603  [0603@1]
R17  390R 1%  R0603  [0603@1]
R18  1K 1%  R0603  [0603@1]
R19  2K  R0603  [0603@1]
R20  100R  R0603  [0603@1]
R21  100R  R0603  [0603@1]
R22  100R  R0603  [0603@1]
R23  100R  R0603  [0603@1]
R24  100R  R0603  [0603@1]
R25  330R  R0603  [0603@1]
R26  0R0 DNI  R0603  [0603@1]
R27  0R0  R0603  [0603@1]
TP4  TEST-POINT-50R-PTH  [TP50-PTH]
TP5  TEST-POINT-50R-PTH  [TP50-PTH]
TP6  TEST-POINT-50R-PTH  [TP50-PTH]
TP7  TEST-POINT-50R-PTH  [TP50-PTH]
U2  LTC2051IMS8  [MSOP8]
U3  LTC2051IMS8  [MSOP8]

### Nets
+3.3V_IF: R15.2 R16.2
ADC0_CH0: C10.1 Q2.3(D2A) TP5.TP ; also sheet 3
ADC0_CH1: C12.2 R19.1 U3.7(OUTB)
ADC1_CH0: C11.1 Q2.7(D1B) TP7.TP ; also sheet 3
ADC1_CH1: TP6.TP U2.1(OUTA) U2.2(-INA) ; also sheet 3
CAL_NETWORK: R21.2 R23.2 R27.1 TP4.TP ; also sheet 7
G1: Q2.8(D2B) R16.1 ; also sheet 3
G2: Q2.6(D1A) R15.1 ; also sheet 3
GND: C10.2 C11.2 C13.2 C14.2 C15.2 R17.2 R18.2 R24.2 U2.4(V-) U3.4(V-) ; also sheet 1,3,4,5,7
N$14: Q2.1(S1) Q2.2(G1) Q2.4(S2) Q2.5(G2) Q3.4(S2) Q3.5(G2)
N$22: Q3.1(S1) Q3.2(G1) R17.1 U3.5(+INB)
N$24: C12.1 R18.1 R19.2 U3.6(-INB)
N$29: Q3.7(D1B) R20.1 U3.2(-INA)
N$30: R21.1 U3.3(+INA)
N$31: Q3.3(D2A) R22.1 U2.6(-INB)
N$33: R23.1 U2.5(+INB)
N$34: Q3.8(D2B) U2.7(OUTB)
N$35: C15.1 R24.1 R25.2 U2.3(+INA)
N$36: R25.1 R26.2 R27.2
OP_VOUT: Q3.6(D1A) U3.1(OUTA)
VBUS: C13.1 C14.1 U2.8(V+) U3.8(V+)
VDD_BRD_PER: R20.2 R22.2 R26.1 ; also sheet 7

## Sheet 7 of 7
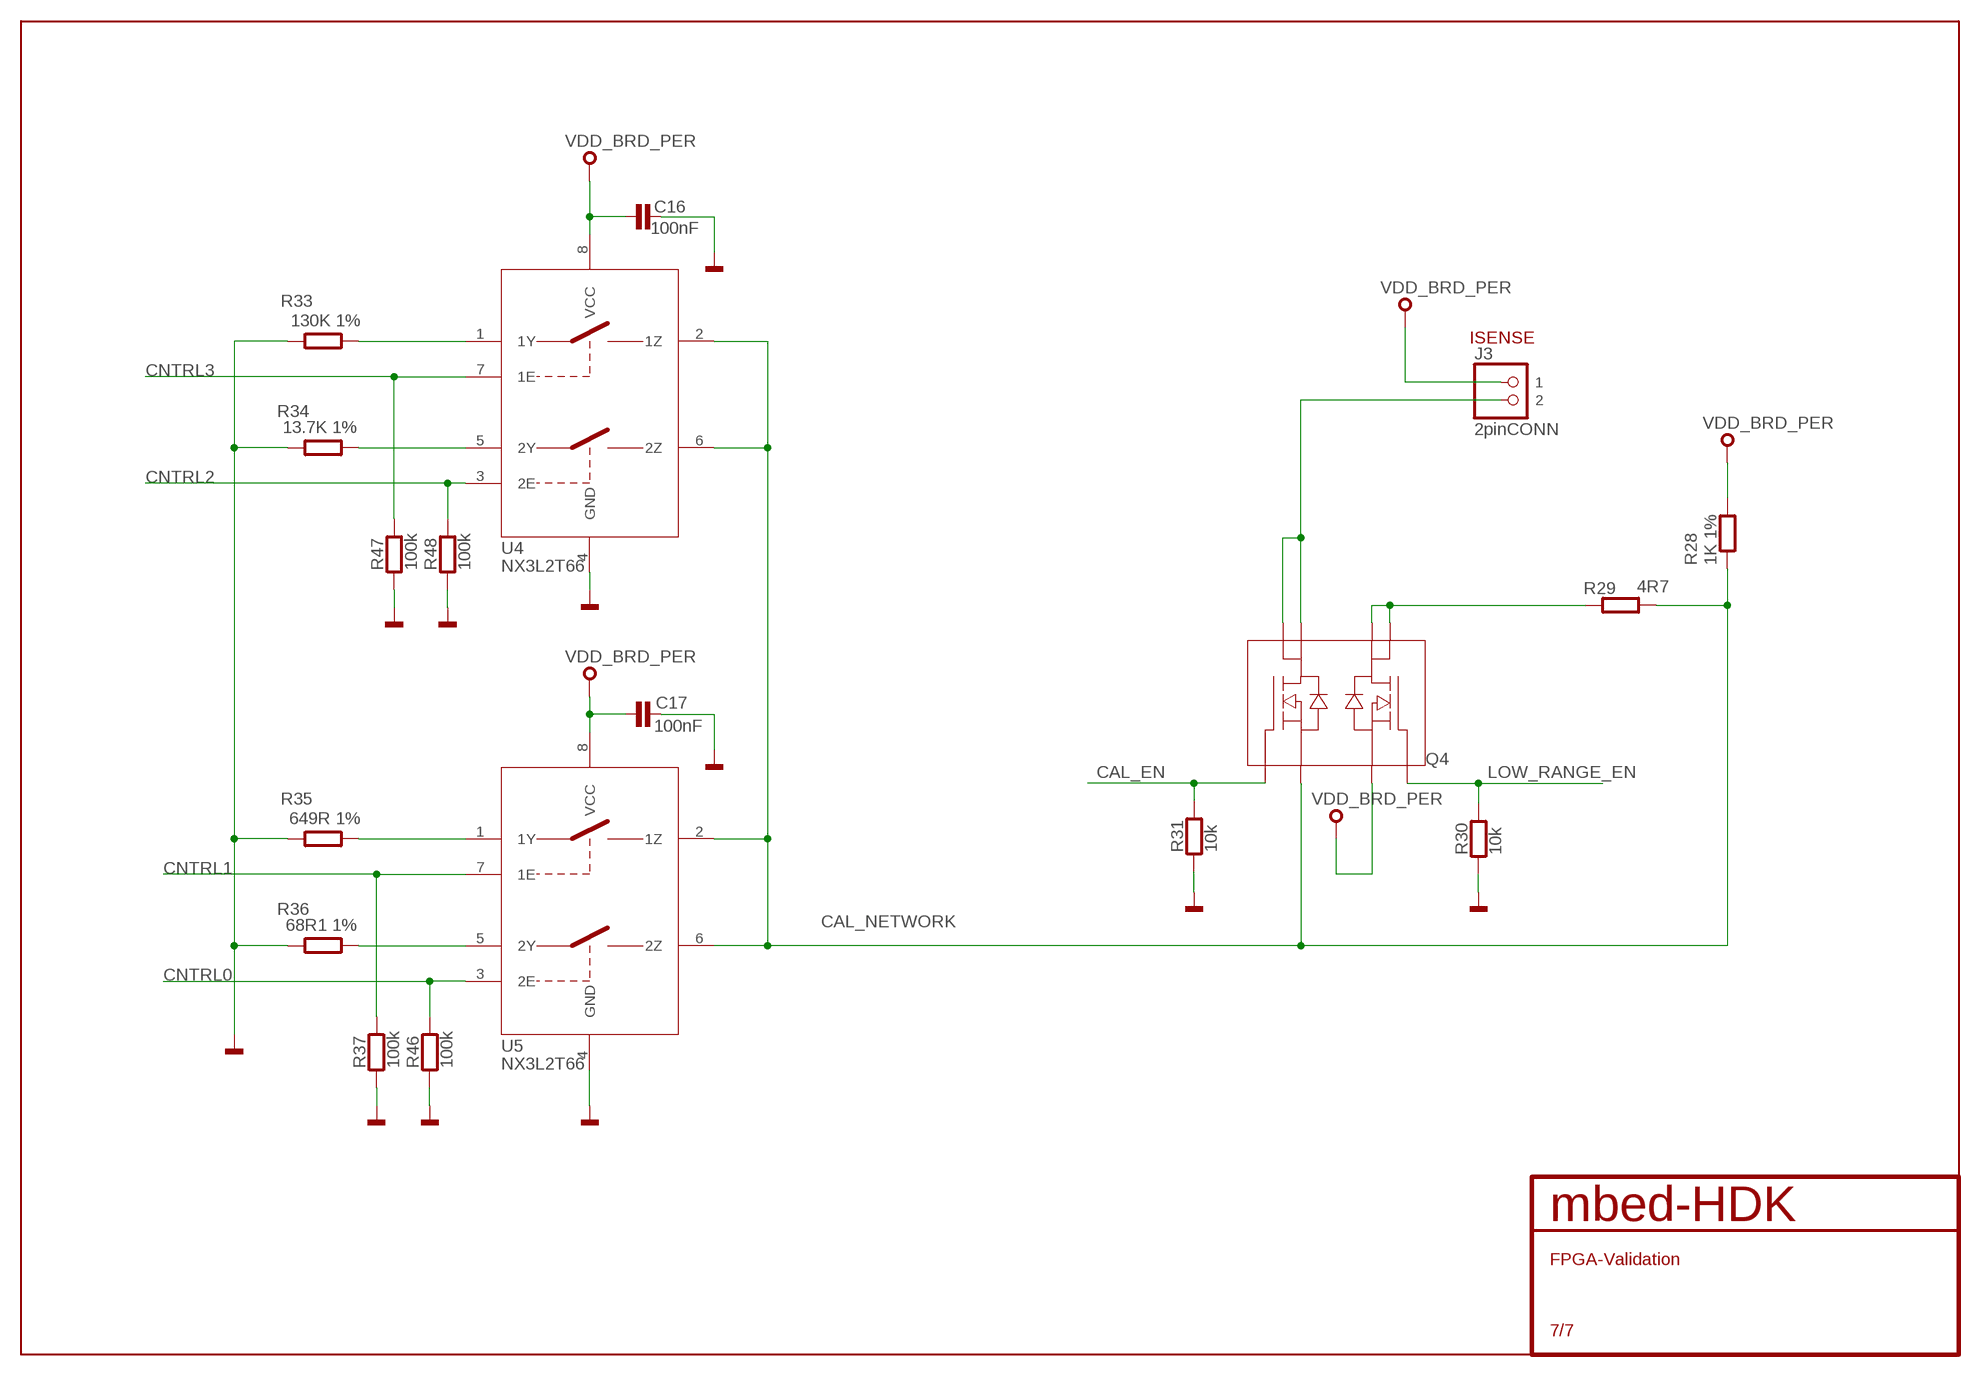
[diagram p6: schematic, sheet 7]

### Parts
C16  100nF  C0603  [0603]
C17  100nF  C0603  [0603]
J3  2pinCONN  PINHD-1X2  [1X02]
Q4  PMDPB55XP  [SOT1118]
R28  1K 1%  R0603  [0603@1]
R29  4R7  R0603  [0603@1]
R30  10k  R0603  [0603@1]
R31  10k  R0603  [0603@1]
R33  130K 1%  R0603  [0603@1]
R34  13.7K 1%  R0603  [0603@1]
R35  649R 1%  R0603  [0603@1]
R36  68R1 1%  R0603  [0603@1]
R37  100k  R0603  [0603@1]
R46  100k  R0603  [0603@1]
R47  100k  R0603  [0603@1]
R48  100k  R0603  [0603@1]
U4  NX3L2T66  [XSON8]
U5  NX3L2T66  [XSON8]

### Nets
CAL_EN: Q4.8(D2B) R31.2 ; also sheet 3
CAL_NETWORK: Q4.3(D2A) R28.1 R29.1 U4.2(1Z) U4.6(2Z) U5.2(1Z) U5.6(2Z) ; also sheet 6
CNTRL0: R46.2 U5.3(2E) ; also sheet 3
CNTRL1: R37.2 U5.7(1E) ; also sheet 3
CNTRL2: R48.2 U4.3(2E) ; also sheet 3
CNTRL3: R47.2 U4.7(1E) ; also sheet 3
GND: C16.1 C17.1 R30.1 R31.1 R33.2 R34.2 R35.2 R36.2 R37.1 R46.1 R47.1 R48.1 U4.4(GND) U5.4(GND) ; also sheet 1,3,4,5,6
LOW_RANGE_EN: Q4.6(D1A) R30.2 ; also sheet 3
N$5: J3.2 Q4.4(S2) Q4.5(G2)
N$6: Q4.1(S1) Q4.2(G1) R29.2
N$38: R33.1 U4.1(1Y)
N$40: R34.1 U4.5(2Y)
N$42: R35.1 U5.1(1Y)
N$43: R36.1 U5.5(2Y)
VDD_BRD_PER: C16.2 C17.2 J3.1 Q4.7(D1B) R28.2 U4.8(VCC) U5.8(VCC) ; also sheet 6

### Notes on the sheet
- ISENSE

## Library data of the parts
C1-C6 = mbed-HDK-RLC:C: Capacitor
C10-C17 = mbed-HDK:C: Capacitor
CON1 = mbed-HDK-Connector:QSH-090-01-L-D-A; DIGIKEY-PN: SAM8182-ND
CON2-CON5 = mbed-HDK-Connector:PINHD-1X32; DIGIKEY-PN: 1212-1924-ND
CON6 CON7 = mbed-HDK-Connector:PINHD-2X6
J3 = mbed-HDK-Connector:PINHD-1X2: PIN HEADER; MF: Wurth; MFN: 61300211121; OC-DIGIKEY: 732-5315-ND; OC-FARNELL: 2356153; OC-MOUSER: 710-61300211121
LED2 LED3 = mbed-HDK-Optical:LED: LED SMD
PTH1-PTH8 = mbed-HDK-misc-Board:FIXINGHOLE
Q2-Q4 = mbed-HDK-Discrete:PMDPB55XP: Double Mosfet; MANUFACTURER: Nexperia; MANUFACTURER-PN: PMDPB55XP,115; MOUSER-PN: 771-PMDPB55XP,115
R2-R14 R32 R38-R45 R49-R52 = mbed-HDK-RLC:R: Resistor
R15-R31 R33-R37 R46-R48 = mbed-HDK:R
TP1-TP3 TP8-TP17 = mbed-HDK-Test:TEST_POINT
TP4-TP7 = mbed-HDK:TEST-POINT
U1 U6-U13 = mbed-HDK-IC:CD74HCT4067
U2 U3 = mbed-HDK-IC:LTC2051IMS8; DIGIKEY-PN: LTC2051IMS8#TRPBFCT-ND; MANUFACTURER: Linear Technology; MANUFACTURER-PN: LTC2051IMS8#TRPBF
U4 U5 = mbed-HDK-IC:NX3L2T66: Analog Switch; DIGIKEY-PN: 568-5560-1-ND; MANUFACTURER: NXP USA Inc.; MANUFACTURER-PN: NX3L2T66GT,115